# EAGLE design PowerAmpTDA2005 (EAGLE 6.4)
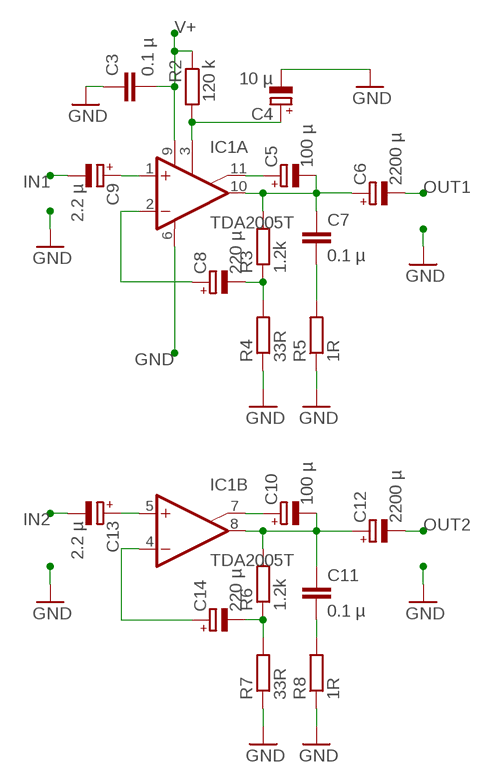
[diagram p0: schematic, sheet 1]

## Parts
C3  0.1 µ  C-EU075-042X103  [C075-042X103]
C4  10 µ  CPOL-EUE2.5-5  [E2,5-5]
C5  100 µ  CPOL-EUE3.5-8  [E3,5-8]
C6  2200 µ  CPOL-EUE5-13  [E5-13]
C7  0.1 µ  C-EU075-042X103  [C075-042X103]
C8  220 µ  CPOL-EUE25-10AXIAL  [E25-10]
C9  2.2 µ  CPOL-EUE2-5  [E2-5]
C10  100 µ  CPOL-EUE3.5-8  [E3,5-8]
C11  0.1 µ  C-EU075-042X103  [C075-042X103]
C12  2200 µ  CPOL-EUE5-13  [E5-13]
C13  2.2 µ  CPOL-EUE2-5  [E2-5]
C14  220 µ  CPOL-EUE25-10AXIAL  [E25-10]
IC1  TDA2005T  [SIP11]
R2  120 k  R-EU_0207/12  [0207/12]
R3  1.2k  R-EU_0207/12  [0207/12]
R4  33R  R-EU_0207/12  [0207/12]
R5  1R  R-EU_0207/12  [0207/12]
R6  1.2k  R-EU_0207/12  [0207/12]
R7  33R  R-EU_0207/12  [0207/12]
R8  1R  R-EU_0207/12  [0207/12]

## Nets
GND: C3.1 C4.- IC1.6(A:GND) R4.1 R5.1 R7.1 R8.1
IN1: C9.-
IN2: C13.-
N$1: C4.+ IC1.3(A:SVRR) R2.2
N$3: C5.+ IC1.11(A:BTSP)
N$4: C5.- C6.+ C7.1 IC1.10(A:OUT) R3.2
N$5: C8.- R3.1 R4.2
N$7: C7.2 R5.2
N$8: C8.+ IC1.2(A:-IN)
N$9: C9.+ IC1.1(A:+IN)
N$12: C13.+ IC1.5(B:+IN)
N$13: C14.+ IC1.4(B:-IN)
N$15: C10.+ IC1.7(B:BTSP)
N$16: C10.- C11.1 C12.+ IC1.8(B:OUT) R6.2
N$18: C14.- R6.1 R7.2
N$19: C11.2 R8.2
OUT1: C6.-
OUT2: C12.-
V+: C3.2 IC1.9(A:V+) R2.1

## Library data of the parts
C3 C7 C11 = rcl:C-EU: CAPACITOR, European symbol
C4-C6 C8-C10 C12-C14 = rcl:CPOL-EU: POLARIZED CAPACITOR, European symbol
IC1 = linear:TDA2005: Power OP AMP
R2-R8 = rcl:R-EU_: RESISTOR, European symbol

## Board
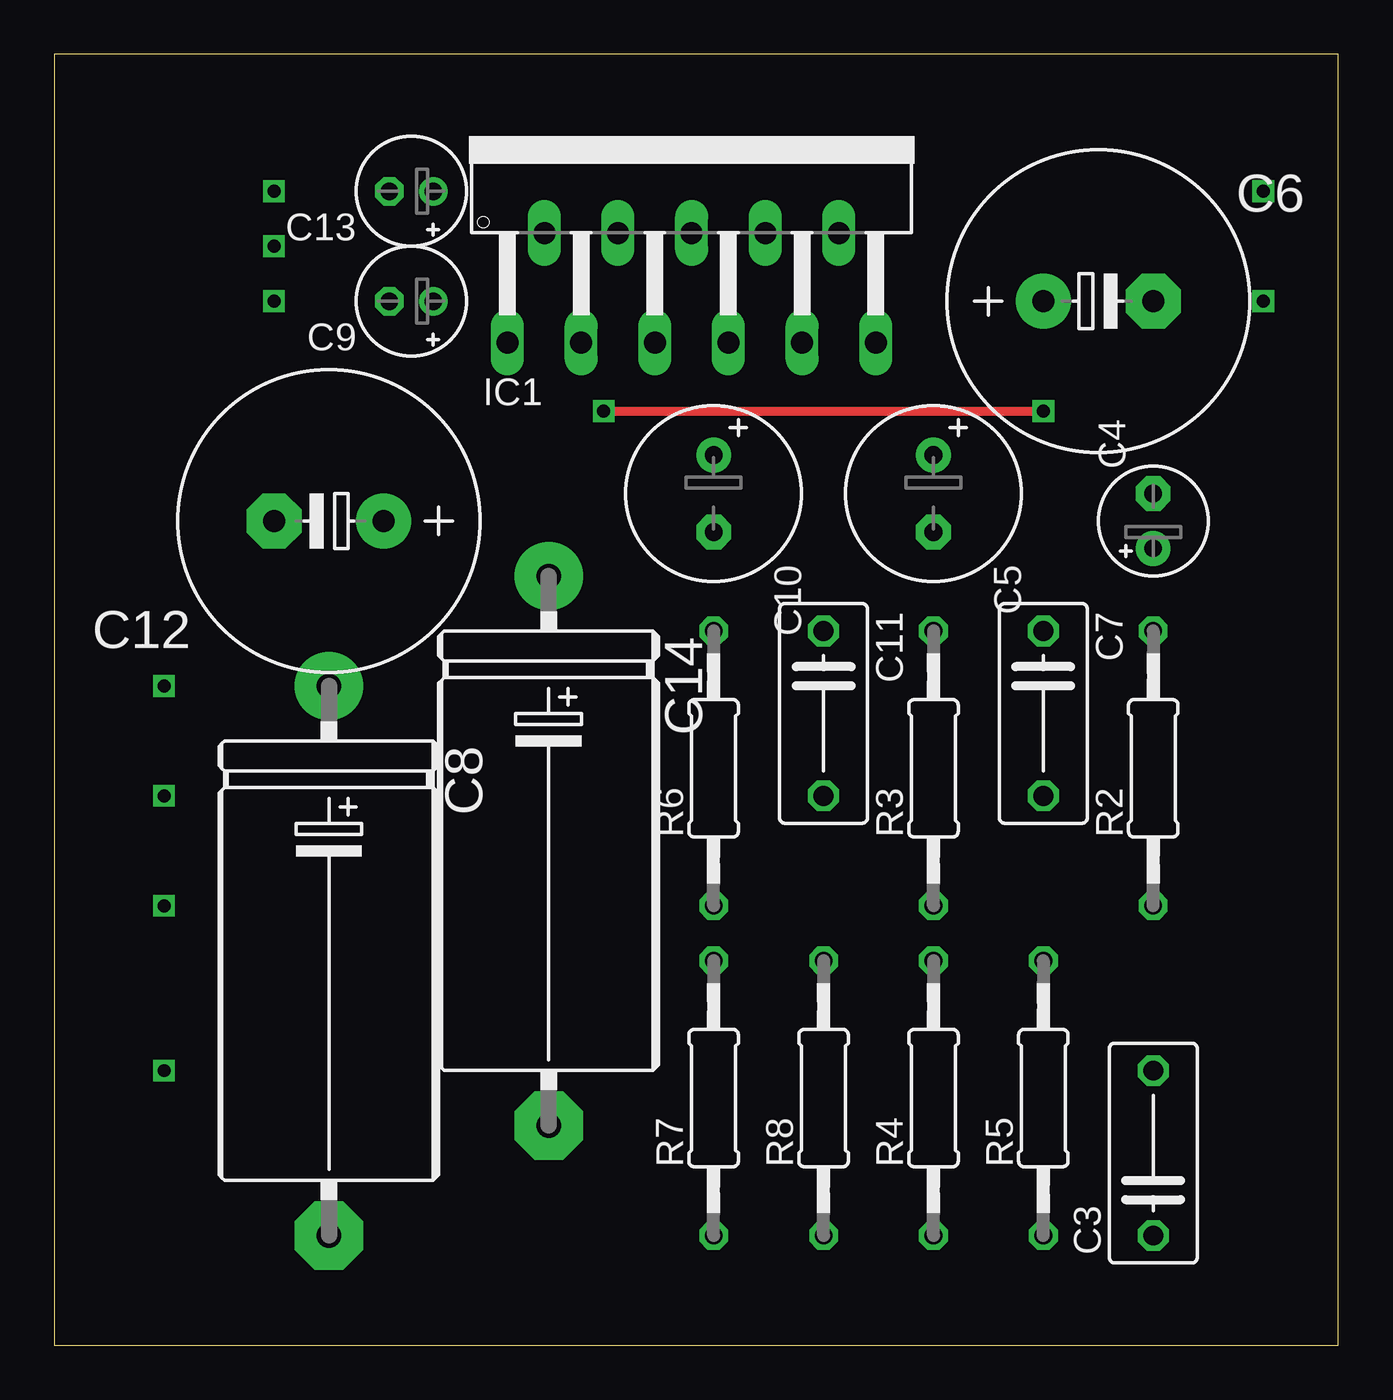
[diagram p1: board, top side]
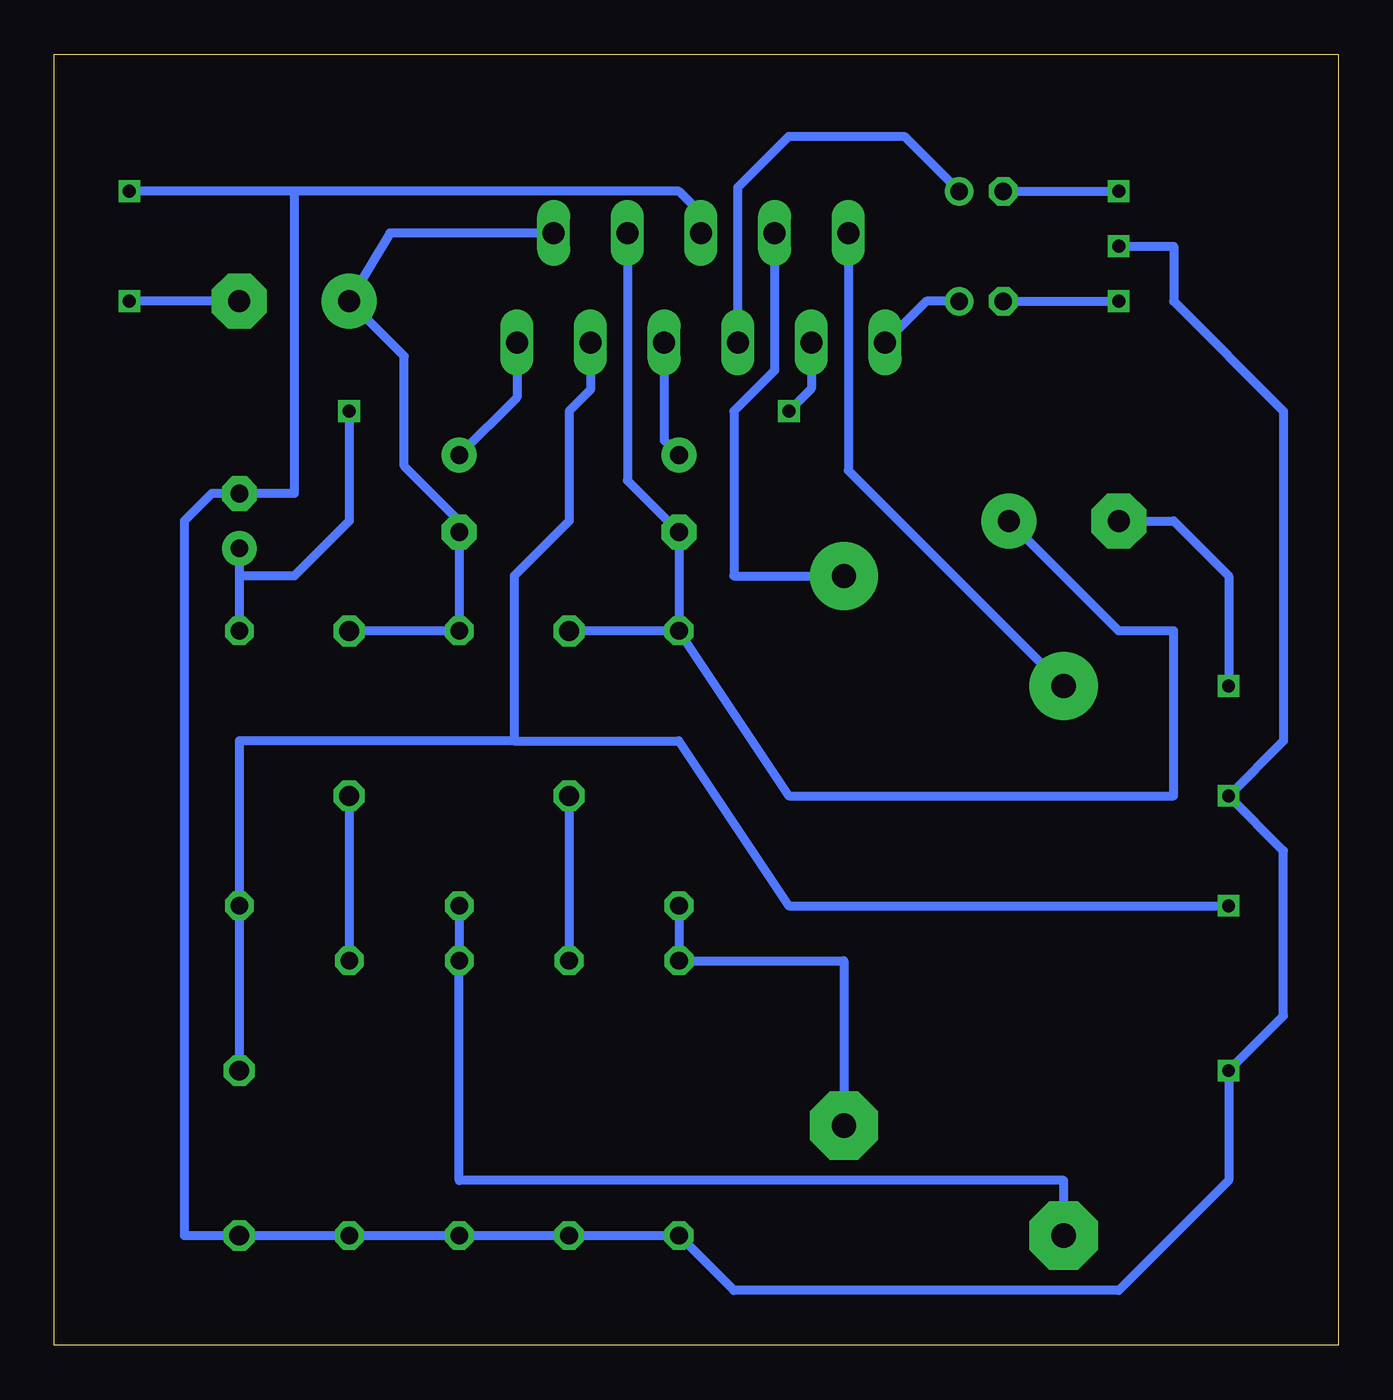
[diagram p2: board, bottom side, seen from below]

Size 59.36 x 59.68 mm. Coordinates in mm from the lower left corner, seen from the top.
Outline: 0,0 59.36,0 59.36,59.68 0,59.68 0,0
Copper layers (1*16): Top 0.035mm / dielectric 1.5mm / Bottom 0.035mm
Design rules "default": minimum track width 10mil, minimum drill 24mil, track to track 8mil, track to pad 8mil, pad to pad 8mil, via to via 8mil, smd to smd 8mil, copper to edge 40mil, drill to drill 8mil, minimum pad ring 10mil, minimum via ring 8mil, stop-mask expansion 4mil, vias tented up to drill 0mil, thermal gap 10mil

### Footprints (pad centres in the part's own frame; a part is rotated, then mirrored left to right if it is on the bottom)
C075-042X103 = drill 0.914 octagon: 1 -3.81,0; 2 3.81,0
E2,5-5 = drill 0.813 pad 1.6: + -1.27,0 | drill 0.813 pad 1.6 octagon: - 1.27,0
E3,5-8 = drill 0.813 pad 1.6: + -1.778,0 | drill 0.813 pad 1.6 octagon: - 1.778,0
E5-13 = drill 1.016 pad 2.54: + -2.54,0 | drill 1.016 pad 2.54 octagon: - 2.54,0
E25-10 = drill 1.118 pad 3.15: + -12.7,0 | drill 1.118 pad 3.15 octagon: - 12.7,0
E2-5 = drill 0.813 pad 1.27: + -1.016,0 | drill 0.813 pad 1.27 octagon: - 1.016,0
SIP11 = drill 1.016 long: 1 -8.509,-9.525; 2 -6.807,-4.47; 3 -5.105,-9.525; 4 -3.404,-4.47; 5 -1.702,-9.525; 6 0,-4.47; 7 1.702,-9.525; 8 3.404,-4.47; 9 5.105,-9.525; 10 6.807,-4.47; 11 8.509,-9.525
0207/12 = drill 0.813 octagon: 1 -6.35,0; 2 6.35,0

### Placement (x,y rotation side)
C3  50.8,8.89 90 top
C4  50.8,38.1 90 top
C5  40.64,39.37 270 top
C6  48.26,48.26 0 top
C7  45.72,29.21 270 top
C8  12.7,17.78 270 top
C9  16.51,48.26 180 top
C10  30.48,39.37 270 top
C11  35.56,29.21 270 top
C12  12.7,38.1 180 top
C13  16.51,53.34 180 top
C14  22.86,22.86 270 top
IC1  29.46,55.88 0 top
R2  50.8,26.67 90 top
R3  40.64,26.67 90 top
R4  40.64,11.43 90 top
R5  45.72,11.43 90 top
R6  30.48,26.67 90 top
R7  30.48,11.43 90 top
R8  35.56,11.43 90 top

### Tracks (layer width: path | path; a pad name or v marks a point on that pad's centre or on a via)
GND  (via drill 0.6)
  Bottom 0.406: IC1.6 29.46,52.32 30.48,53.34 48.26,53.34 | 48.26,53.34 48.26,39.37 C4.- 52.07,39.37 53.34,38.1 53.34,5.08 C3.1 R5.1 R4.1 R8.1 R7.1 27.94,2.54 10.16,2.54 5.08,7.62 v5.08,12.7 2.54,15.24 2.54,22.86 v5.08,25.4 2.54,27.94 2.54,43.18 7.62,48.26 7.62,50.8 v10.16,50.8 | 48.26,53.34 v55.88,53.34
IN1  (via drill 0.6)
  Bottom 0.406: C9.- v10.16,48.26
IN2  (via drill 0.6)
  Bottom 0.406: C13.- v10.16,53.34
N$1  (via drill 0.6)
  Top 0.406: v25.4,43.18 v45.72,43.18
  Bottom 0.406: C4.+ 50.8,35.56 | 50.8,35.56 R2.2 | IC1.3 24.36,44.22 v25.4,43.18 | v45.72,43.18 45.72,38.1 48.26,35.56 50.8,35.56
N$3
  Bottom 0.406: IC1.11 37.97,43.81 C5.+
N$4
  Bottom 0.406: IC1.10 43.84,51.41 C6.+ 43.18,45.72 43.18,40.64 40.64,38.1 C5.- R3.2 C7.1
N$5
  Bottom 0.406: R3.1 R4.2 40.64,7.62 12.7,7.62 C8.-
N$7
  Bottom 0.406: C7.2 R5.2
N$8
  Bottom 0.406: IC1.2 22.66,40.44 C8.+
N$9
  Bottom 0.406: C9.+ 19.05,48.26 IC1.1
N$12
  Bottom 0.406: IC1.5 27.76,53.52 25.4,55.88 20.07,55.88 C13.+
N$13
  Bottom 0.406: IC1.4 26.06,45.06 27.94,43.18 27.94,35.56 C14.+
N$15
  Bottom 0.406: IC1.7 31.17,41.83 C10.+
N$16
  Bottom 0.406: R6.2 C11.1 | R6.2 C10.- 32.87,39.98 IC1.8 | R6.2 25.4,25.4 7.62,25.4 7.62,33.02 10.16,33.02 C12.+
N$18
  Bottom 0.406: R6.1 R7.2 22.86,17.78 C14.-
N$19
  Bottom 0.406: C11.2 R8.2
OUT1  (via drill 0.6)
  Bottom 0.406: C6.- v55.88,48.26
OUT2  (via drill 0.6)
  Bottom 0.406: C12.- 7.62,38.1 5.08,35.56 v5.08,30.48
V+  (via drill 0.6)
  Bottom 0.406: C3.2 R2.1 50.8,27.94 38.1,27.94 | IC1.9 34.57,44.17 35.56,43.18 35.56,38.1 38.1,35.56 38.1,27.94 | 38.1,27.94 30.48,27.94 25.4,20.32 v5.08,20.32